# Altium schematic sheet IPT_Secondary_Converter.SchDoc: Secondary Converter
size A3; Author: Pranav G & Manoj K; Organization: University Of Auckland; Address1: 20 Symonds Street,; Address2: Auckland CBD,; Address3: Auckland 1010,; Address4: New Zealand; DocumentNumber: 1; Revision: 1; SheetNumber: 1; SheetTotal: 1
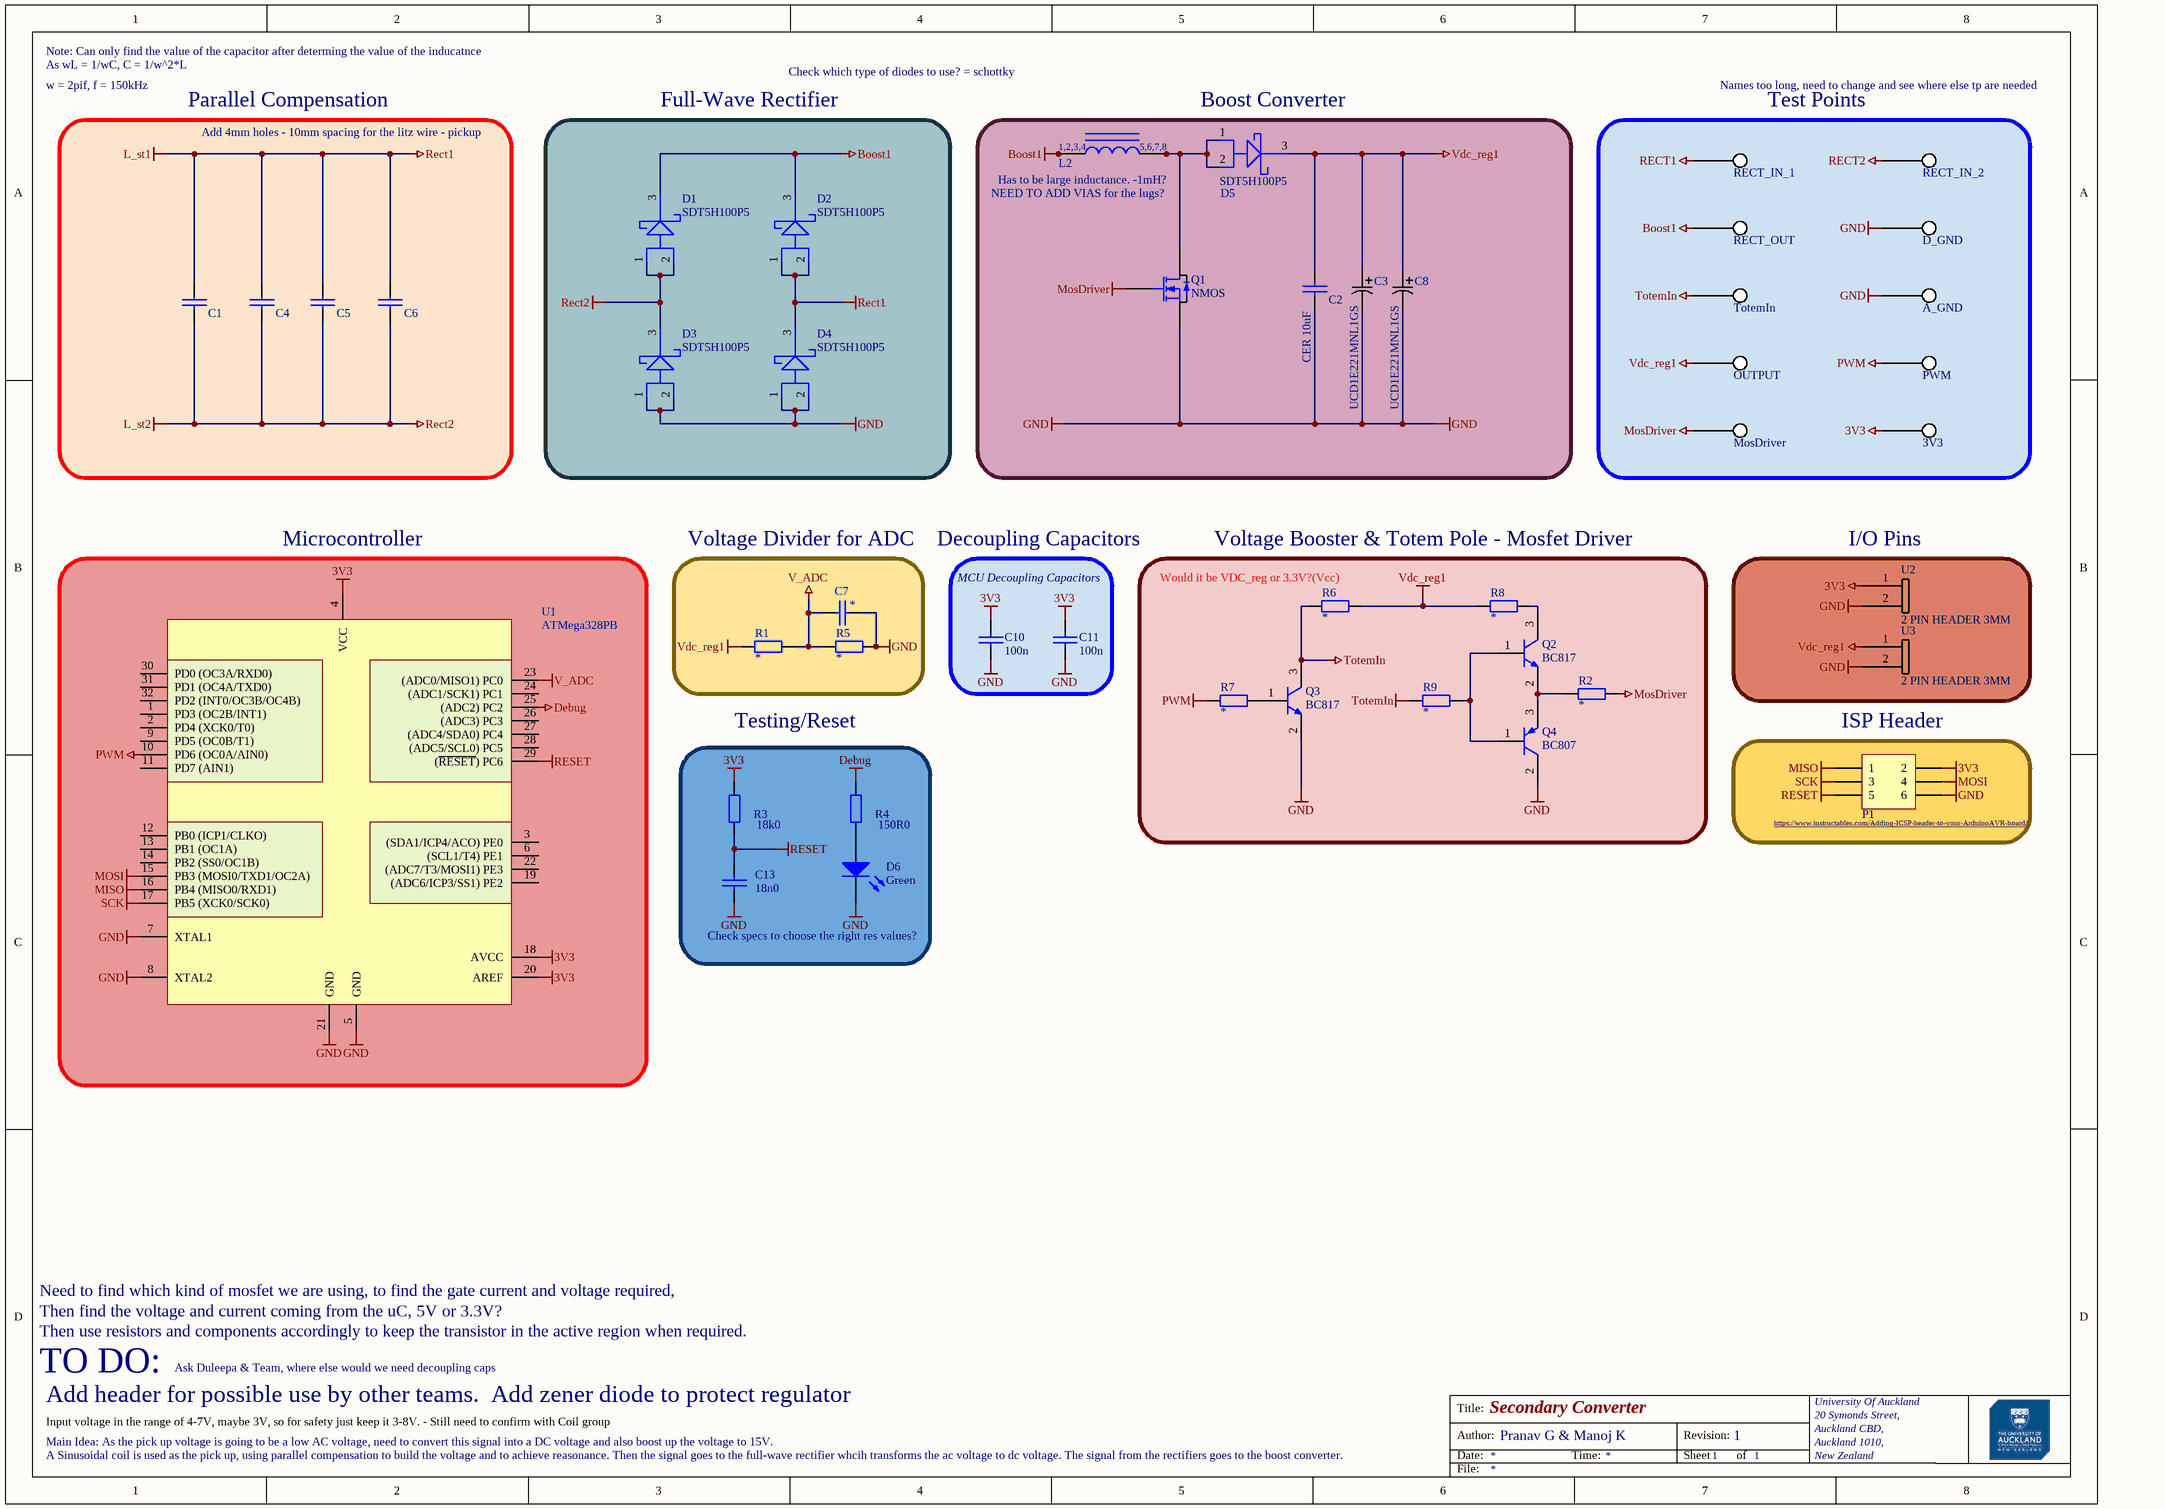
[diagram p0: IPT_Secondary_Converter.SchDoc]

## Parts
3V3  TP_DIR  [TP5015]  (value not drawn)
A_GND  TP_GND  [TP5015]  (value not drawn)
C1  CCAP5750  [C5750]  (value not drawn)
C2  CER 10uF  [C1210]
C3  UCD1E221MNL1GS  [PCAP_8x10-ELECT_NCA]
C4  CCAP5750  [C5750]  (value not drawn)
C5  CCAP5750  [C5750]  (value not drawn)
C6  CCAP5750  [C5750]  (value not drawn)
C7  *  [C0805]
C8  UCD1E221MNL1GS  [PCAP_8x10-ELECT_NCA]
C10  100n  [C0805]
C11  100n  [C0805]
C13  18n0  [C0805]
D1  SDT5H100P5  [DIO_PDS360-13]
D2  SDT5H100P5  [DIO_PDS360-13]
D3  SDT5H100P5  [DIO_PDS360-13]
D4  SDT5H100P5  [DIO_PDS360-13]
D5  SDT5H100P5  [DIO_PDS360-13]
D6  Green  [LED]
D_GND  TP_GND  [TP5015]  (value not drawn)
L2  Inductor  [EFD20]  (value not drawn)
MosDriver  TP_DIR  [TP5015]  (value not drawn)
OUTPUT  TP_DIR  [TP5015]  (value not drawn)
P1  HDR3X2  [HDR2X3_2P54]  (value not drawn)
PWM  TP_DIR  [TP5015]  (value not drawn)
Q1  NMOS  [BSC072N08NS5ATMA1_modified_v2]
Q2  BC817  [SOT95P230X110-3N]
Q3  BC817  [SOT95P230X110-3N]
Q4  BC807  [SOT95P230X110-3N]
R1  *  [0805 RES]
R2  *  [0805 RES]
R3  18k0  [R0805]
R4  150R0  [R0805]
R5  *  [0805 RES]
R6  *  [0805 RES]
R7  *  [0805 RES]
R8  *  [0805 RES]
R9  *  [0805 RES]
RECT_IN_1  TP_DIR  [TP5015]  (value not drawn)
RECT_IN_2  TP_DIR  [TP5015]  (value not drawn)
RECT_OUT  TP_TX  [TP5015]  (value not drawn)
TotemIn  TP_GND  [TP5015]  (value not drawn)
U1  ATMega328PB  [TQFP32]
U2  2 PIN HEADER 3MM  [3mm_holes]
U3  2 PIN HEADER 3MM  [3mm_holes]

## Blocks framed on the sheet
Parallel Compensation: C1 C4-C6
Full-Wave Rectifier: D1-D4
Boost Converter: C2 C3 C8 D5 L2 Q1
Test Points: 3V3 A_GND D_GND MosDriver OUTPUT PWM RECT_IN_1 RECT_IN_2 RECT_OUT TotemIn
Microcontroller: U1
Voltage Divider for ADC: C7 R1 R5
MCU Decoupling Capacitors: C10 C11
Voltage Booster & Totem Pole - Mosfet Driver: Q2-Q4 R2 R6-R9
I/O Pins: U2 U3
Testing/Reset: C13 D6 R3 R4
ISP Header: P1

## Nets
3V3: 3V3.1 C10.2 C11.2 P1.2 R3.2 U1.4(VCC) U1.18(AVCC) U1.20(AREF) U2.1
Boost1: D1.3 D2.3 L2.1 L2.2 L2.3 L2.4 RECT_OUT.1
Debug: R4.2 U1.25((ADC2)_PC2)
GND: A_GND.1 C2.1 C3.2 C7.1 C8.2 C10.1 C11.1 C13.1 D3.1 D3.2 D4.1 D4.2 D6.2(K) D_GND.1 P1.6 Q1.1(S) Q3.2 Q4.2 R5.2 U1.5(GND) U1.7(XTAL1) U1.8(XTAL2) U1.21(GND) U2.2 U3.2
L_st1: C1.2 C4.2 C5.2 C6.2 D2.1 D2.2 D4.3 RECT_IN_1.1  [also labelled Rect1]
L_st2: C1.1 C4.1 C5.1 C6.1 D1.1 D1.2 D3.3 RECT_IN_2.1  [also labelled Rect2]
MISO: P1.1 U1.16(PB4_(MISO0/RXD1))
MosDriver: MosDriver.1 Q1.4(G) R2.2
MOSI: P1.4 U1.15(PB3_(MOSI0/TXD1/OC2A))
PWM: PWM.1 R7.1 U1.10(PD6_(OC0A/AIN0))
RESET: C13.2 P1.5 R3.1 U1.29((~{RESET})_PC6)
SCK: P1.3 U1.17(PB5_(XCK0/SCK0))
TotemIn: Q3.3 R6.2 R9.2 TotemIn.1
V_ADC: C7.2 R1.2 R5.1 U1.23((ADC0/MISO1)_PC0)
Vdc_reg1: C2.2 C3.1 C8.1 D5.3 OUTPUT.1 R1.1 R6.1 R8.2 U3.1
NetD5_1: D5.1 D5.2 L2.5 L2.6 L2.7 L2.8 Q1.8(D)
NetD6_1: D6.1(A) R4.1
NetQ2_1: Q2.1 Q4.1 R9.1
NetQ2_2: Q2.2 Q4.3 R2.1
NetQ2_3: Q2.3 R8.1
NetQ3_1: Q3.1 R7.2

Not connected (* = marked no-connect by the designer): U1 1(PD3_(OC2B/INT1)) 2(PD4_(XCK0/T0)) 3((SDA1/ICP4/ACO)_PE0) 6((SCL1/T4)_PE1) 9(PD5_(OC0B/T1)) 11(PD7_(AIN1)) 12(PB0_(ICP1/CLKO)) 13(PB1_(OC1A)) 14(PB2_(SS0/OC1B)) 19((ADC6/ICP3/SS1)_PE2) 22((ADC7/T3/MOSI1)_PE3) 24((ADC1/SCK1)_PC1) 26((ADC3)_PC3) 27((ADC4/SDA0)_PC4) 28((ADC5/SCL0)_PC5) 30(PD0_(OC3A/RXD0)) 31(PD1_(OC4A/TXD0)) 32(PD2_(INT0/OC3B/OC4B))

## Notes on the sheet
- Note: Can only find the value of the capacitor after determing the value of the inducatnce
- As wL = 1/wC, C = 1/w^2*L
- w = 2pif, f = 150kHz
- Check which type of diodes to use? = schottky
- Names too long, need to change and see where else tp are needed
- Add 4mm holes - 10mm spacing for the litz wire - pickup
- Has to be large inductance. -1mH?
- NEED TO ADD VIAS for the lugs?
- Decoupling Capacitors
- (near R6) Would it be VDC_reg or 3.3V?(Vcc)
- (near P1) https://www.instructables.com/Adding-ICSP-header-to-your-ArduinoAVR-board/
- Check specs to choose the right res values?
- Need to find which kind of mosfet we are using, to find the gate current and voltage required,
- Then find the voltage and current coming from the uC, 5V or 3.3V?
- TO DO:
- Then use resistors and components accordingly to keep the transistor in the active region when required.
- Ask Duleepa & Team, where else would we need decoupling caps
- A Sinusoidal coil is used as the pick up, using parallel compensation to build the voltage and to achieve reasonance. Then the signal goes to the full-wave rectifier whcih transforms the ac voltage to dc voltage. The signal from the rectifiers goes to the boost converter.
- Main Idea: As the pick up voltage is going to be a low AC voltage, need to convert this signal into a DC voltage and also boost up the voltage to 15V.
- Add header for possible use by other teams.  Add zener diode to protect regulator
- Input voltage in the range of 4-7V, maybe 3V, so for safety just keep it 3-8V. - Still need to confirm with Coil group
- Title:
- Author:
- Date:
- Time:
- Revision:
- Sheet
- of
- File:
- (in symbol Inductor EFD20) 1,2,3,4; 5,6,7,8

## Library data of the parts
3V3 A_GND D_GND MosDriver OUTPUT PWM RECT_IN_1 RECT_IN_2 RECT_OUT TotemIn = TP_5015: SM Test Point 5015
C1 C4 C5 = CCAP5750: CCAP1210
C2 = CCAP1210: Ceramic, 10uF
C3 C8 = UCD1E221MNL1GS: 220µF 25V Aluminum Electrolytic Capacitors Radial, Can - SMD 5000 Hrs @ 105°C; Vendor: Nichicon; Built_By: EMA_UL_Team; SourceLibrary: Nichicon_2011-10-21; Type: DEV; Manufacturer_Part_Number: UCD1E221MNL1GS; Copyright: Copyright (C) 2018 Accelerated Designs. All rights reserved; RefDes: RefDes
C6 = CCAP5750: https://product.tdk.com/info/en/documents/chara_sheet/C5750X7R2E474K230KM.pdf
C7 C10 C11 C13 = CCAP0805
D1-D5 = SDT5H100P5-7DICT-ND
D6 = LED_TH_2P54: Typical throughole GaAs LED with 2.54mm pitch; Manufacturer: Generic Components; Class I: Optoelectronic; Published: 8-Jun-2000; Revision: July-2002: Re-released for DXP Platform.; Publisher: Altium Limited; Class II: LED; Value: Green
L2 = Inductor EFD20: Inductor with core
P1 = HDR3X2: Header, 3-Pin, Dual row
Q1 = NMOS OptiMOS BSC072N08NS5ATMA1: MOSFET N-CH 80V 74A 8TDSON; Manufacturer: Infineon Technologies; Type: Surface mount; MPN: BSC072N08NS5ATMA1; Supplier 1: Element14; Part Description: MOSFET N-CH 80V 74A 8TDSON; Supplier Part Number 3: 726-BSC072N08NS5ATMA; Supplier Part Number 1: 2725812; Supplier 3: Mouser; Supplier Part Number 2: BSC072N08NS5ATMA1CT-ND; Supplier 2: Digi-Key
Q2 Q3 = BC817: BC817-40,215. NPN GP 500 45V SOT23; ComponentLink1Description: Datasheet; ComponentLink1URL: https://share.engineering.auckland.ac.nz/ece/ts/Student%20Documents/BC817_BC817W_BC337.pdf
Q4 = BC807: BC807-40,215.  PNP GP 500MA 45V SOT23; ComponentLink1Description: Datasheet; ComponentLink1URL: https://share.engineering.auckland.ac.nz/ece/ts/Student%20Documents/BC807_BC807W_BC327.pdf
R1 R2 R5-R9 = Res_SMT_0805: 0805 resistor; Published: 8-Jun-2000; LatestRevisionDate: 17-Jul-2002; LatestRevisionNote: Re-released for DXP Platform.; PackageReference: AXIAL-0.4; Publisher: Altium Limited; Value: *; ComponentLink1Description: https://nz.mouser.com/datasheet/2/315/AOA0000C304-1149620.pdf
R3 R4 = RES0805
U1 = ATMega328PB: IC MCU 8BIT 32KB FLASH 32TQFP; Supplier 1: Digi-Key; Supplier Part Number 1: ATMEGA328PB-AU-ND; Supplier 2: Digikey; Supplier Part Number 2: ATMEGA328PB-AU-ND
U2 U3 = HEADER_2PIN: 3MM HOLES